# Altium project PTT Mic Filter.PrjPcb
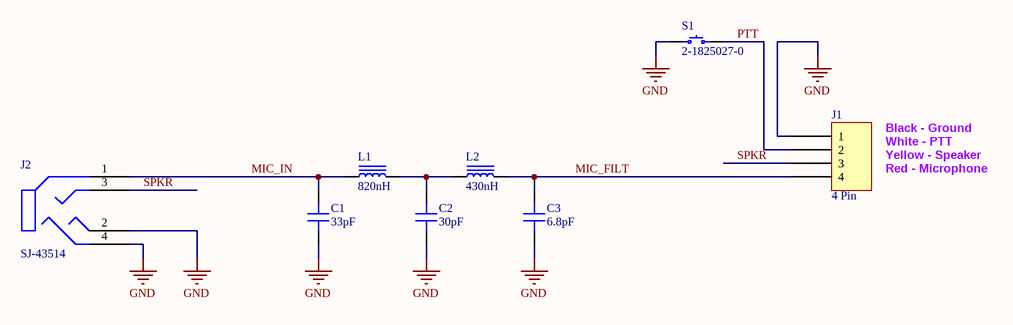
[diagram p0: PTT Mic Filter.SchDoc]
1 sheet, 8 parts. Net scope: global (net labels, ports and power ports of the same name join across sheets).
Board file: PTT Board.PcbDoc

## Sheet PTT Mic Filter.SchDoc: Push To Talk + Mic RF Filter
size A4

### Parts
C1  33pF  [CAP 0603_1608]
C2  30pF  [CAP 0603_1608]
C3  6.8pF  [CAP 0603_1608]
J1  4 Pin  [Wire2Board]
J2  SJ-43514  [CUI SJ-43514]
L1  820nH  [IND 0603_1608 RF WW]
L2  430nH  [IND 0603_1608 RF WW]
S1  2-1825027-0  [TE 2-1825027-0]

### Nets
GND: C1.1 C2.1 C3.1 J1.1 J2.2(TIP) J2.4(RING_2) S1.1
MIC_FILT: C3.2 J1.4 L2.2
MIC_IN: C1.2 J2.1(SLEEVE) L1.1
PTT: J1.2 S1.2
SPKR: J1.3 J2.3(RING_1)
NetC2_2: C2.2 L1.2 L2.1

### Notes on the sheet
- White - PTT
- Red - Microphone
- Black - Ground
- Yellow - Speaker
- Title
- Size:
- Date:
- A4
- Number:
- Time:
- Revision:
- Sheet
- of
- File:

### Library data of the parts
C1 = 06035A330KAT2A: CAP CER 33PF 50V C0G/NP0 0603; Manufacturer: AVX Corporation; Temperature Coefficient: C0G, NP0; Tolerance: ±10%; Part Number: 06035A330KAT2A; Value: 33pF; Applications: General Purpose; Capacitance: 33pF; ComponentLink1Description: Datasheet; ComponentLink1URL: http://datasheets.avx.com/C0GNP0-Dielectric.pdf; ComponentLink2Description: DigiKey Link; ComponentLink2URL: http://digikey.com/product-detail/en/avx-corporation/06035A330KAT2A/478-12701-1-ND/9949235; Device Package: 0603 (1608 Metric); LastUpdated: 02/09/2020 01:03:28; Lifecycle Status: Active; Minimum Order: 1; Mounting Type: Surface Mount, MLCC; Operating Temperature: -55°C ~ 125°C; Package / Case: 0603 (1608 Metric); Packaging: TapeAndReel; PartId: 6504; Part Status: Active; Price: 0.01; Series: -; Size / Dimension: 0.063" L x 0.032" W (1.60mm x 0.81mm); Supplier 1: DigiKey; Supplier Part Number 1: 478-12701-1-ND; Thickness (Max): 0.035" (0.90mm); Voltage - Rated: 50V
C2 = CL10C300JB8NNNC: CAP CER 30PF 50V C0G/NP0 0603; Manufacturer: Samsung Electro-Mechanics; Temperature Coefficient: C0G, NP0; Tolerance: ±5%; Part Number: CL10C300JB8NNNC; Value: 30pF; Applications: General Purpose; Capacitance: 30pF; ComponentLink1Description: Datasheet; ComponentLink1URL: http://www.samsungsem.com/kr/support/product-search/mlcc/CL10C300JB8NNNC.jsp; ComponentLink2Description: DigiKey Link; ComponentLink2URL: http://digikey.com/product-detail/en/samsung-electro-mechanics/CL10C300JB8NNNC/1276-1021-1-ND/3889107; Device Package: 0603 (1608 Metric); LastUpdated: 02/09/2020 01:03:30; Lifecycle Status: Active; Minimum Order: 1; Mounting Type: Surface Mount, MLCC; Operating Temperature: -55°C ~ 125°C; Package / Case: 0603 (1608 Metric); Packaging: TapeAndReel; PartId: 5764; Part Status: Active; Price: 0.01; Series: CL; Size / Dimension: 0.063" L x 0.031" W (1.60mm x 0.80mm); Supplier 1: DigiKey; Supplier Part Number 1: 1276-1021-1-ND; Thickness (Max): 0.035" (0.90mm); Voltage - Rated: 50V
C3 = 06035A6R8DAT2A: CAP CER 6.8PF 50V NP0 0603; Manufacturer: AVX Corporation; Temperature Coefficient: C0G, NP0; Tolerance: ±0.5pF; Part Number: 06035A6R8DAT2A; Value: 6.8pF; Applications: General Purpose; Capacitance: 6.8pF; ComponentLink1Description: Datasheet; ComponentLink1URL: http://datasheets.avx.com/C0GNP0-Dielectric.pdf; ComponentLink2Description: DigiKey Link; ComponentLink2URL: http://digikey.com/product-detail/en/avx-corporation/06035A6R8DAT2A/478-10335-1-ND/6797496; Device Package: 0603 (1608 Metric); LastUpdated: 02/09/2020 01:03:30; Lifecycle Status: Active; Minimum Order: 1; Mounting Type: Surface Mount, MLCC; Operating Temperature: -55°C ~ 125°C; Package / Case: 0603 (1608 Metric); Packaging: TapeAndReel; PartId: 5815; Part Status: Active; Price: 0.01; Series: -; Size / Dimension: 0.063" L x 0.032" W (1.60mm x 0.81mm); Supplier 1: DigiKey; Supplier Part Number 1: 478-10335-1-ND; Thickness (Max): 0.035" (0.90mm); Voltage - Rated: 50V
J2 = SJ-43514: CONN JACK 4COND 3.5MM R/A; Manufacturer: CUI Devices; Actual Diameter: 0.142" (3.60mm); Connector Type: Phone Jack; Gender: Female; Industry Recognized Mating Diameter: 3.50mm (0.141", 1/8", Mini Plug) - Headphone; Internal Switch(s): Does Not Contain Switch; Number of Positions/Contacts: 4 Conductors, 4 Contacts; Shielding: Unshielded; Signal Lines: Stereo (4 Conductor, TRRS); Part Number: SJ-43514; ComponentLink1Description: Datasheet; ComponentLink1URL: https://www.cuidevices.com/product/resource/digikeypdf/sj-4351x.pdf; ComponentLink2Description: DigiKey Link; ComponentLink2URL: http://digikey.com/product-detail/en/cui-devices/SJ-43514/CP-43514-ND/368146; LastUpdated: 06/09/2020 11:27:36; Lifecycle Status: Active; Minimum Order: 1; Mounting Type: Through Hole, Right Angle; Operating Temperature: -20°C ~ 85°C; Packaging: Tray; Part Status: Active; Price: 1.06; Series: SJ; Supplier 1: DigiKey; Supplier Part Number 1: CP-43514-ND; Termination: Solder
L1 = BRC1608TR82M6: FIXED IND 820NH 730MA 176 MOHM; Manufacturer: Taiyo Yuden; Current - Saturation: 950mA; Frequency - Self Resonant: 560MHz; Inductance Frequency - Test: 6MHz; Material - Core: Ferrite; Shielding: Unshielded; Tolerance: ±20%; Type: Wirewound; Part Number: BRC1608TR82M6; ComponentLink1Description: Datasheet; ComponentLink1URL: https://ds.yuden.co.jp/TYCOMPAS/ut/detail?pn=BRC1608TR82M6  &u=M; ComponentLink2Description: DigiKey Link; ComponentLink2URL: http://digikey.com/product-detail/en/taiyo-yuden/BRC1608TR82M6/587-3224-1-ND/3479477; Current Rating (Amps): 730mA; DC Resistance (DCR): 176mOhm; Device Package: 0603 (1608 Metric); Height - Seated (Max): 0.039" (1.00mm); Inductance: 820nH; LastUpdated: 06/09/2020 11:05:21; Lifecycle Status: Active; Minimum Order: 1; Mounting Type: Surface Mount; Operating Temperature: -40°C ~ 105°C; Package / Case: 0603 (1608 Metric); Packaging: TapeAndReel; PartId: 1489; Part Status: Active; Price: 0.12; Series: BR, C Type; Size / Dimension: 0.063" L x 0.031" W (1.60mm x 0.80mm); Supplier 1: DigiKey; Supplier Part Number 1: 587-3224-1-ND; Supplier Device Package: 0603 (1608 Metric); Value: 820nH
L2 = BRC1608TR43M6: FIXED IND 430NH 1.1A 82 MOHM SMD; Manufacturer: Taiyo Yuden; Current - Saturation: 1.4A; DC Resistance (DCR): 82mOhm; Frequency - Self Resonant: 740MHz; Inductance Frequency - Test: 6MHz; Material - Core: Ferrite; Shielding: Unshielded; Tolerance: ±20%; Type: Wirewound; Part Number: BRC1608TR43M6; ComponentLink1Description: Datasheet; ComponentLink1URL: https://ds.yuden.co.jp/TYCOMPAS/ut/detail?pn=BRC1608TR43M6  &u=M; ComponentLink2Description: DigiKey Link; ComponentLink2URL: http://digikey.com/product-detail/en/taiyo-yuden/BRC1608TR43M6/587-3220-1-ND/3479466; Current Rating (Amps): 1.1A; Device Package: 0603 (1608 Metric); Height - Seated (Max): 0.039" (1.00mm); Inductance: 430nH; LastUpdated: 06/09/2020 11:05:21; Lifecycle Status: Active; Minimum Order: 1; Mounting Type: Surface Mount; Operating Temperature: -40°C ~ 105°C; Package / Case: 0603 (1608 Metric); Packaging: TapeAndReel; PartId: 1442; Part Status: Active; Price: 0.12; Series: BR, C Type; Size / Dimension: 0.063" L x 0.031" W (1.60mm x 0.80mm); Supplier 1: DigiKey; Supplier Part Number 1: 587-3220-1-ND; Supplier Device Package: 0603 (1608 Metric); Value: 430nH
S1 = 2-1825027-0: SWITCH TACTILE SPST-NO 0.05A 24V; Manufacturer: TE Connectivity ALCOSWITCH Switches; Actuator Length, Right Angle: 11.85mm; Actuator Orientation: Side Actuated; Actuator Type: Standard; Contact Rating @ Voltage: 0.05A @ 24VDC; Illumination: Non-Illuminated; Operating Force: 160gf; Outline: 7.11mm x 6.60mm; Switch Function: Off-Mom; Part Number: 2-1825027-0; Circuit: SPST-NO; ComponentLink1Description: Datasheet; ComponentLink1URL: https://www.te.com/commerce/DocumentDelivery/DDEController?Action=srchrtrv&DocNm=1308111-1_SWITCHES_CORE_PROGRAM_CATALOG&DocType=CS&DocLang=English; ComponentLink2Description: DigiKey Link; ComponentLink2URL: http://digikey.com/product-detail/en/te-connectivity-alcoswitch-switches/2-1825027-0/450-1661-ND/1632547; LastUpdated: 06/09/2020 11:08:27; Lifecycle Status: Active; Minimum Order: 1; Mounting Type: Through Hole, Right Angle; Operating Temperature: -35°C ~ 85°C; Packaging: Bulk; Part Status: Active; Price: 0.22; Series: FSMRAJ; Supplier 1: DigiKey; Supplier Part Number 1: 450-1661-ND; Termination Style: PC Pin